# Altium schematic sheet [03] - POWER.SchDoc
size A3; DocumentNumber: 3; SheetNumber: 3; SheetTotal: 6
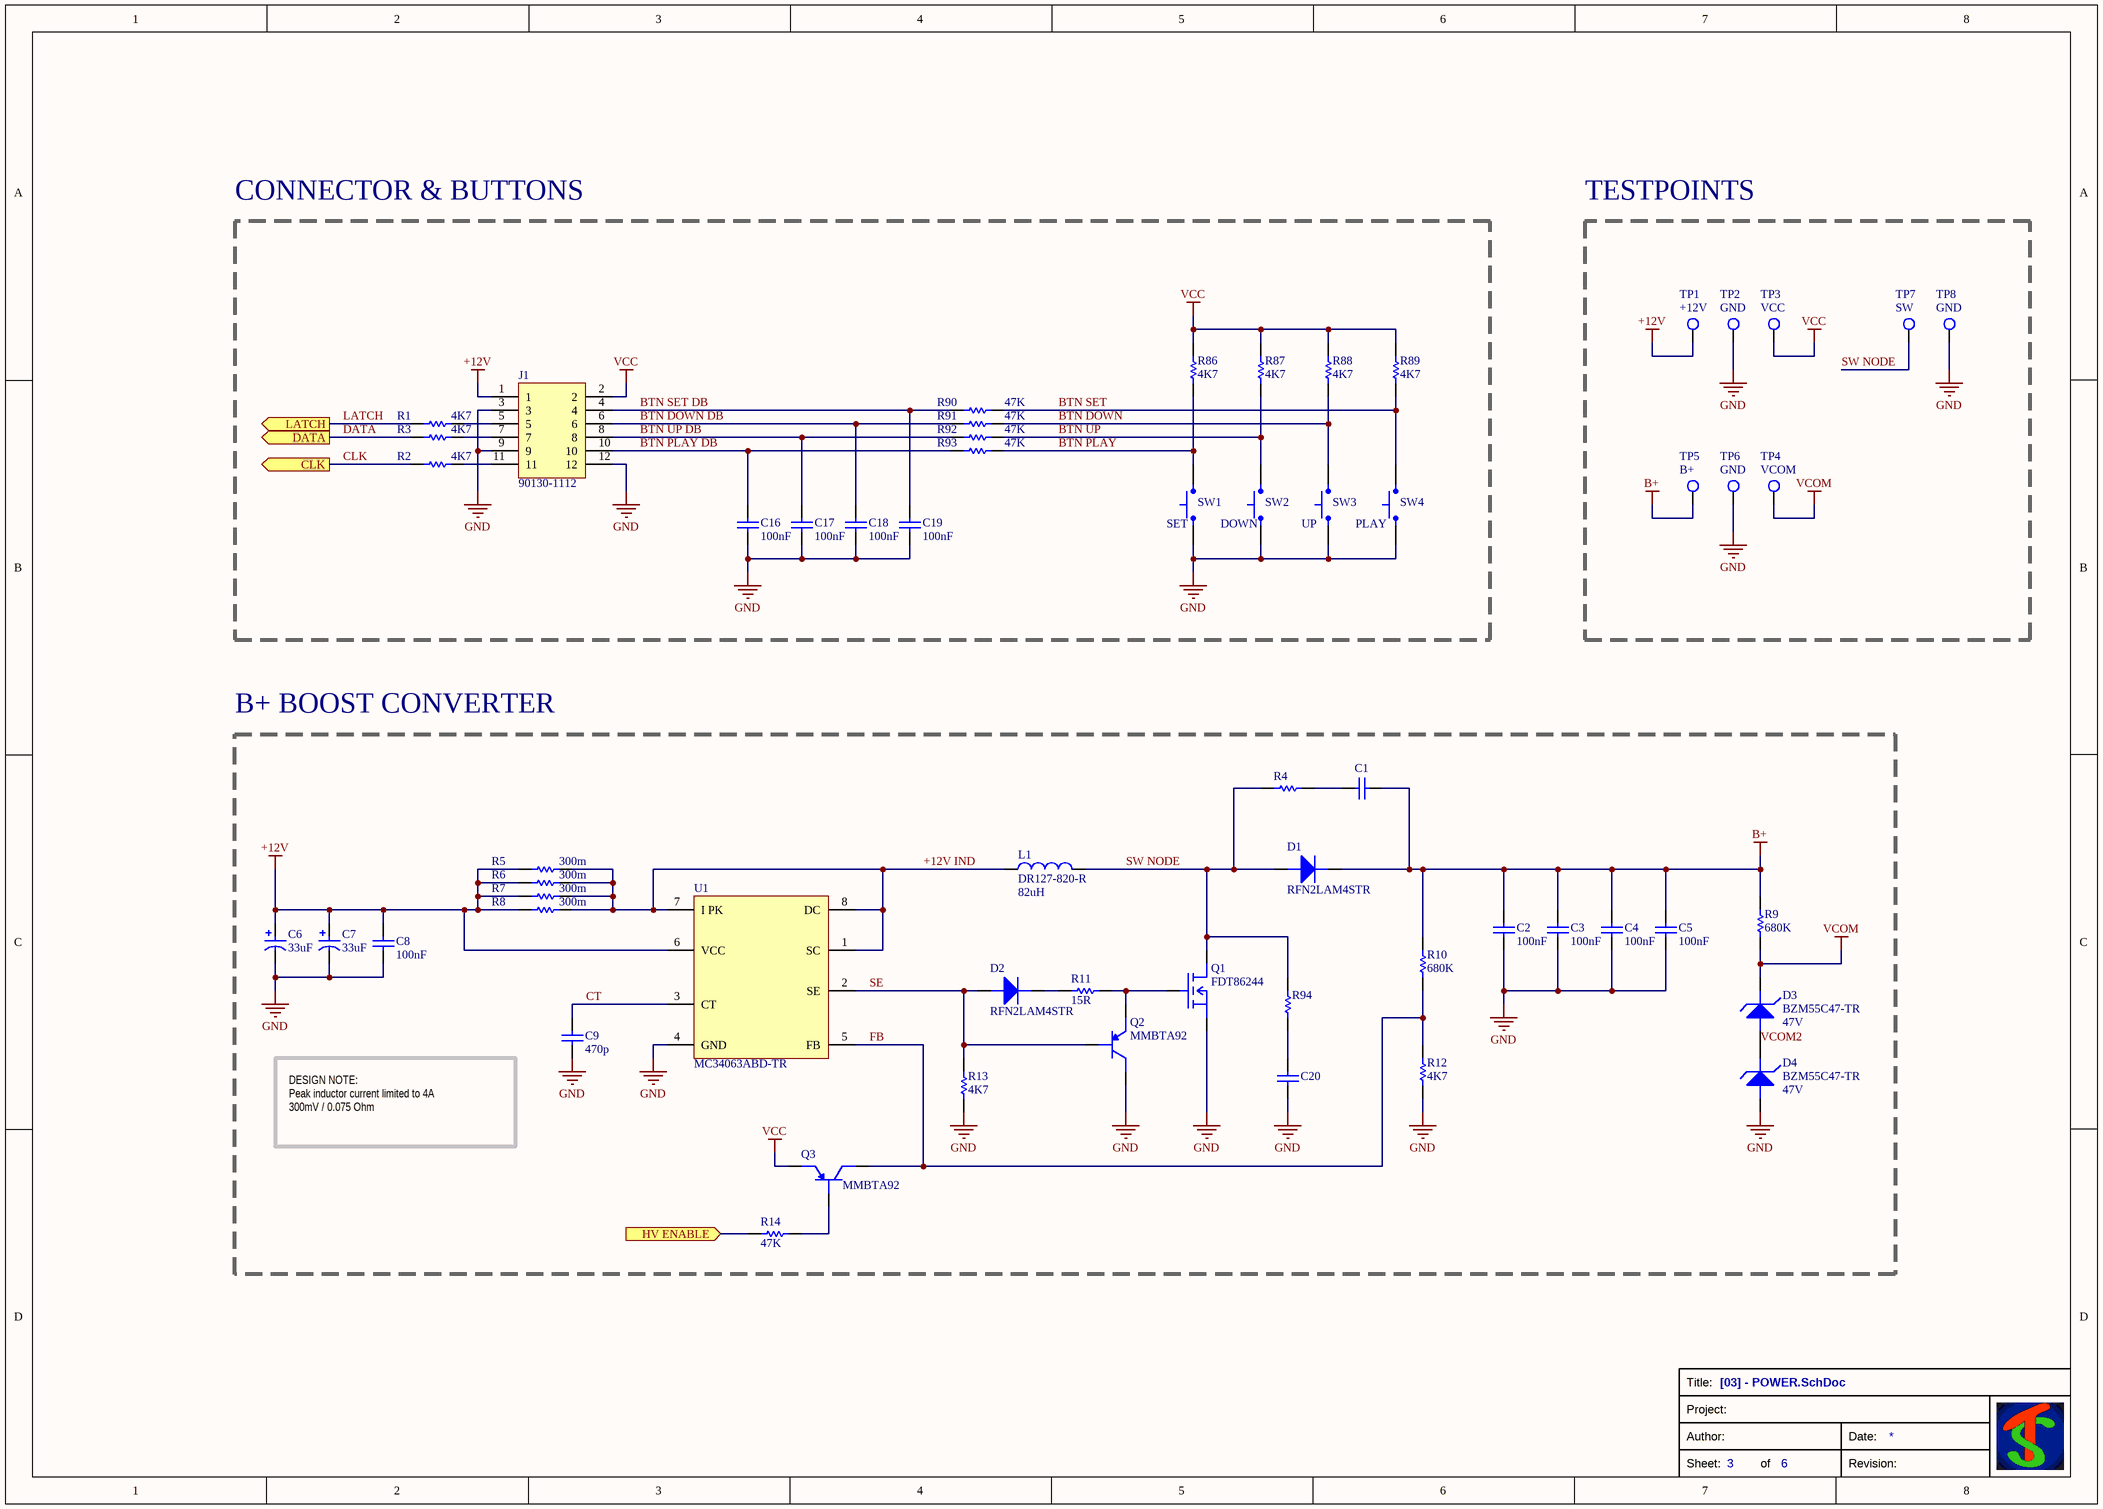
[diagram p0: [03] - POWER.SchDoc]

## Parts
C1  885342208002  [CAP-1206]  (value not drawn)
C2  value 100nF  [CAP-1206]  (hidden comment: 885342208002)
C3  value 100nF  [CAP-1206]  (hidden comment: 885342208002)
C4  value 100nF  [CAP-1206]  (hidden comment: 885342208002)
C5  value 100nF  [CAP-1206]  (hidden comment: 885342208002)
C6  value 33uF  [CAPAE7366X60M]  (hidden comment: A768EB336M1GLAE045)
C7  value 33uF  [CAPAE7366X60M]  (hidden comment: A768EB336M1GLAE045)
C8  value 100nF  [CAP-1206]  (hidden comment: 885342208002)
C9  value 470p  [CAP-0805]  (hidden comment: VJ0805A471JXBCW1BC)
C16  value 100nF  [CAP-1206]  (hidden comment: 885342208002)
C17  value 100nF  [CAP-1206]  (hidden comment: 885342208002)
C18  value 100nF  [CAP-1206]  (hidden comment: 885342208002)
C19  value 100nF  [CAP-1206]  (hidden comment: 885342208002)
C20  885342208002  [CAP-1206]  (value not drawn)
D1  RFN2LAM4STR  [SODFL472X100-2M]
D2  RFN2LAM4STR  [SODFL472X100-2M]
D3  BZM55C47-TR  Zener Voltage: 47V  [DIOMELF1913M]
D4  BZM55C47-TR  Zener Voltage: 47V  [DIOMELF1913M]
J1  90130-1112  [SHDR12W65P254_2X6_1758X975X1110P]
L1  DR127-820-R  value 82uH  [IND-DR127]
Q1  FDT86244  [SOT230P700X180-4M]
Q2  MMBTA92  [SOT95P240X110-3N]
Q3  MMBTA92  [SOT95P240X110-3N]
R1  value 4K7  [RES-0805]  (hidden comment: RT0805FRE134K7L)
R2  value 4K7  [RES-0805]  (hidden comment: RT0805FRE134K7L)
R3  value 4K7  [RES-0805]  (hidden comment: RT0805FRE134K7L)
R4  RT1206FRE07680KL  [RES-1206]  (value not drawn)
R5  value 300m  [RES-0805]  (hidden comment: ERJ-U6QFR30V)
R6  value 300m  [RES-0805]  (hidden comment: ERJ-U6QFR30V)
R7  value 300m  [RES-0805]  (hidden comment: ERJ-U6QFR30V)
R8  value 300m  [RES-0805]  (hidden comment: ERJ-U6QFR30V)
R9  value 680K  [RES-1206]  (hidden comment: RT1206FRE07680KL)
R10  value 680K  [RES-1206]  (hidden comment: RT1206FRE07680KL)
R11  value 15R  [RES-0805]  (hidden comment: CR0805-JW-150ELF)
R12  value 4K7  [RES-0805]  (hidden comment: RT0805FRE134K7L)
R13  value 4K7  [RES-0805]  (hidden comment: RT0805FRE134K7L)
R14  value 47K  [RES-0805]  (hidden comment: RT0805FRE0747KL)
R86  value 4K7  [RES-0805]  (hidden comment: RT0805FRE134K7L)
R87  value 4K7  [RES-0805]  (hidden comment: RT0805FRE134K7L)
R88  value 4K7  [RES-0805]  (hidden comment: RT0805FRE134K7L)
R89  value 4K7  [RES-0805]  (hidden comment: RT0805FRE134K7L)
R90  value 47K  [RES-0805]  (hidden comment: RT0805FRE0747KL)
R91  value 47K  [RES-0805]  (hidden comment: RT0805FRE0747KL)
R92  value 47K  [RES-0805]  (hidden comment: RT0805FRE0747KL)
R93  value 47K  [RES-0805]  (hidden comment: RT0805FRE0747KL)
R94  RT1206FRE07680KL  [RES-1206]  (value not drawn)
SW1  SET  [Push Button 6mm TH]
SW2  DOWN  [Push Button 6mm TH]
SW3  UP  [Push Button 6mm TH]
SW4  PLAY  [Push Button 6mm TH]
TP1  +12V  [TESTPOINT-TH-1.3mm]  (no BOM)
TP2  GND  [TESTPOINT-TH-1.3mm]  (no BOM)
TP3  VCC  [TESTPOINT-TH-1.3mm]  (no BOM)
TP4  VCOM  [TESTPOINT-TH-1.3mm]  (no BOM)
TP5  B+  [TESTPOINT-TH-1.3mm]  (no BOM)
TP6  GND  [TESTPOINT-TH-1.3mm]  (no BOM)
TP7  SW  [TESTPOINT-TH-1.3mm]  (no BOM)
TP8  GND  [TESTPOINT-TH-1.3mm]  (no BOM)
U1  MC34063ABD-TR  [SOIC-8_3.9X4.9]

## Blocks framed on the sheet
CONNECTOR & BUTTONS: C16-C19 J1 R1-R3 R86-R93 SW1-SW4
TESTPOINTS: TP1-TP8
B+ BOOST CONVERTER: C1-C9 C20 D1-D4 L1 Q1-Q3 R4-R14 R94 U1

## Ports
CLK (out), DATA (out), HV ENABLE (in), LATCH (out)

## Nets
+12V: C6.1(P) C7.1(P) C8.2 J1.1 R5.1 R6.1 R7.1 R8.1 TP1.1 U1.6(VCC)
B+: C1.1 C2.2 C3.2 C4.2 C5.2 D1.2(C) R9.2 R10.2 TP5.1
GND: C2.1 C3.1 C4.1 C5.1 C6.2(N) C7.2(N) C8.1 C9.1 C16.1 C17.1 C18.1 C19.1 C20.1 D4.1(A) J1.3 J1.9 J1.12 Q1.3(SOURCE) Q2.3(C) R12.1 R13.1 SW1.1 SW2.1 SW3.1 SW4.1 TP2.1 TP6.1 TP8.1 U1.4(GND)
VCC: J1.2 Q3.2(E) R86.2 R87.2 R88.2 R89.2 TP3.1
VCOM: D3.2(C) R9.1 TP4.1
+12V IND: L1.1 R5.2 R6.2 R7.2 R8.2 U1.1(SC) U1.7(I_PK) U1.8(DC)
BTN DOWN: R88.1 R91.2 SW3.2
BTN DOWN DB: C18.2 J1.6 R91.1
BTN PLAY: R86.1 R93.2 SW1.2
BTN PLAY DB: C16.2 J1.10 R93.1
BTN SET: R89.1 R90.2 SW4.2
BTN SET DB: C19.2 J1.4 R90.1
BTN UP: R87.1 R92.2 SW2.2
BTN UP DB: C17.2 J1.8 R92.1
CLK: R2.1 ; port CLK
CT: C9.2 U1.3(CT)
DATA: R3.1 ; port DATA
FB: Q3.3(C) R10.1 R12.2 U1.5(FB)
HV ENABLE: R14.1 ; port HV ENABLE
LATCH: R1.1 ; port LATCH
SE: D2.1(A) Q2.1(B) R13.2 U1.2(SE)
SW NODE: D1.1(A) L1.2 Q1.2(DRAIN) R4.2 R94.2 TP7.1
VCOM2: D3.1(A) D4.2(C)
NetC1_2: C1.2 R4.1
NetC20_2: C20.2 R94.1
NetD2_2: D2.2(C) R11.1
NetJ1_5: J1.5 R1.2
NetJ1_7: J1.7 R3.2
NetJ1_11: J1.11 R2.2
NetQ1_1: Q1.1(GATE) Q2.2(E) R11.2
NetQ3_1: Q3.1(B) R14.2

## Notes on the sheet
- DESIGN NOTE:
  Peak inductor current limited to 4A
  300mV / 0.075 Ohm
  Max output current 40mA
- Title:
- Project:
- Sheet:
- Author:
- of
- Revision:
- Date:

## Library data of the parts
C1 C20 = CAP-1206-100n-885342208002: Condensatori in ceramica multistrato MLCC - SMD/SMT WCAP-CSMH 200V 0.1uF 1206 10%; Manufacturer: Wurth Elektronik; Dielectric: X7R; Value: 100nF; Voltage Rating: 200V; Tolerance: 10%; Supplier 1: Mouser; Supplier Part Number 1: 710-885342208002
C2-C5 C8 C16-C19 = CAP-1206-100n-885342208002: Condensatori in ceramica multistrato MLCC - SMD/SMT WCAP-CSMH 200V 0.1uF 1206 10%; Manufacturer: Wurth Elektronik; Dielectric: X7R; Voltage Rating: 200V; Tolerance: 10%; Supplier 1: Mouser; Supplier Part Number 1: 710-885342208002
C6 C7 = CAP-CAN-33u-A768EB336M1GLAE045: Condensatori a polimeri organici in alluminio 40V 33uF 20% ESR=45mOhms; Manufacturer: KEMET; Voltage Rating DC: 16 VDC; Voltage Rating: 16V; Dielectric: X7R; Tolerance: 20%; Supplier 1: Mouser; Supplier Part Number 1: 80-A768EB336M1GLAE45
C9 = CAP-0805-470p-VJ0805A471JXBCW1BC: Condensatori in ceramica multistrato MLCC - SMD/SMT 0805 470pF 100volts C0G 5%; Manufacturer: Wurth Elektronik; Voltage Rating DC: 16 VDC; Voltage Rating: 16V; Tolerance: 20%; Dielectric: X5R; Supplier 1: Mouser; Supplier Part Number 1: 77-VJ0805A471JXBCBC
D1 D2 = DIODE-RFN2LAM4STR: Diodi - Uso generico, alimentazione, commutazione 400V 1.5A Io PMDTM; Supplier 1: Mouser; Supplier Part Number 1: 755-RFN2LAM4STR; Reverse Voltage: 400V; Forward Current: 1.5A
D3 D4 = ZENER-47V-BZM55C47-TR: Diodi Zener 47 Volt 0.5W 5%; Supplier 1: Mouser; Supplier Part Number 1: 78-BZM55C47
J1 = HEADER-12x2-2.54-TH-90130-1112: Terminali e capicorda 2.54MM CGRIDIII HDR 12P V DR SHRD TIN; Manufacturer_Name: Molex; Datasheet Link: https://www.molex.com/pdm_docs/sd/901301112_sd.pdf; Height: 11.1mm; Manufacturer_Part_Number: 90130-1112; Supplier 1: Mouser; Supplier Part Number 1: 538-90130-1112
L1 = IND-DR127-82u: Induttori fissi 82uH 4.0A 0.143ohms; Manufacturer: Taiyo Yuden; Tolerance: 30%; Max DC Current: 4A; Max DC Resistance: 143m; Supplier 1: Mouser; Supplier Part Number 1: 704-DR127-820-R
Q1 = NMOS-FDT86244: MOSFET 150V N-Channel PowerTrench MOSFET; Supplier 1: Mouser; Supplier Part Number 1: 512-FDT86244
Q2 Q3 = PNP-MMBTA92: 300V PNP SMALL SIGNAL TRANSISTOR IN SOT23; Supplier 1: Mouser; Supplier Part Number 1: 621-MMBTA92-F
R1-R3 R12 R13 R86-R89 = RES-0805-4K7-RT0805FRE134K7L: Thin Film Resistors 4.7K ohm 1% 50 ppm; Manufacturer: Yageo; Power Rating: 1/10W; Voltage Rating: 75V; Tolerance: 1%; Supplier 1: Mouser; Supplier Part Number 1: 603-RT0805FRE134K7L
R4 R9 R10 R94 = RES-1206-680K-RT1206FRE07680KL: Thin Film Resistors 680K OHM 1% 50PPM 1/4W; Manufacturer: Yageo; Power Rating: 1/10W; Voltage Rating: 75V; Tolerance: 1%; Supplier 1: Mouser; Supplier Part Number 1: 603-RT1206FRE07680KL
  R4 R94: Value: 680K
R5-R8 = RES-0805-300m-ERJ-U6QFR30V: Resistori a pellicola spessa - SMD 0805 0.25W 1% .30ohms AEC-Q200; Manufacturer: Yageo; Power Rating: 1/10W; Voltage Rating: 75V; Tolerance: 1%; Supplier 1: Mouser; Supplier Part Number 1: 667-ERJ-U6QFR30V
R11 = RES-0805-15R-ERJ-CR0805-JW-150ELF: Resistori a pellicola spessa - SMD 15ohm 5%; Manufacturer: Bourns; Power Rating: 1/8W; Voltage Rating: 150V; Tolerance: 5%; Supplier 1: Mouser; Supplier Part Number 1: 652-CR0805JW-150ELF
R14 R90-R93 = RES-0805-47K-RT0805FRE0747KL: Thin Film Resistors 1/8W 47K ohm 1% 50ppm; Manufacturer: Yageo; Power Rating: 1/10W; Voltage Rating: 75V; Tolerance: 1%; Supplier 1: Mouser; Supplier Part Number 1: 603-RT0805FRE0747KL
SW1-SW4 = Push Button 6mm TH
TP1-TP8 = TESTPOINT-TH-1.3mm
U1 = MC34063ABD-TR: DC-DC Converter 3.0 to 40V; Supplier 1: Mouser; Supplier Part Number 1: 511-MC34063ABD-TR